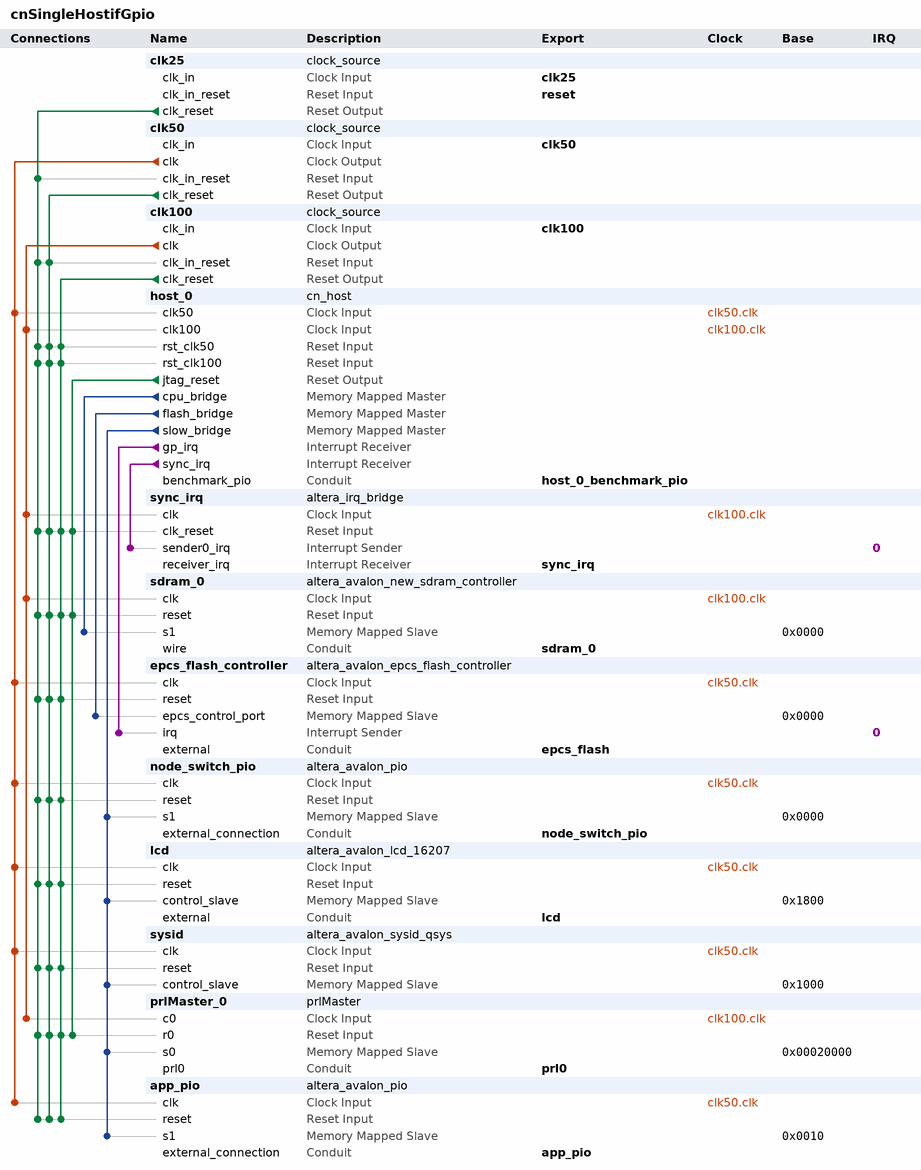
[diagram p0: system contents]
# Platform Designer (Qsys) system cnSingleHostifGpio, Cyclone IV E EP4CE115F29C7
# Parameters at their usual value, and those the tool derives, are not listed.
package require -exact qsys 13.0
create_system cnSingleHostifGpio
set_project_property DEVICE_FAMILY {Cyclone IV E}
set_project_property DEVICE EP4CE115F29C7

add_instance clk25 clock_source 13.0
set_instance_parameter_value clk25 clockFrequency 25000000

add_instance clk50 clock_source 13.0
set_instance_parameter_value clk50 clockFrequency 50000000

add_instance clk100 clock_source 13.0
set_instance_parameter_value clk100 clockFrequency 100000000

add_instance host_0 cn_host 1.0

add_instance sync_irq altera_irq_bridge 13.0
set_instance_parameter_value sync_irq IRQ_WIDTH 1

add_instance sdram_0 altera_avalon_new_sdram_controller 13.0.1.99.2
set_instance_parameter_value sdram_0 TAC 6.0
set_instance_parameter_value sdram_0 TRCD 20.0
set_instance_parameter_value sdram_0 TRP 20.0
set_instance_parameter_value sdram_0 casLatency 3
set_instance_parameter_value sdram_0 columnWidth 10
set_instance_parameter_value sdram_0 dataWidth 32
set_instance_parameter_value sdram_0 generateSimulationModel false
set_instance_parameter_value sdram_0 model single_Micron_MT48LC4M32B2_7_chip
set_instance_parameter_value sdram_0 numberOfBanks 4
set_instance_parameter_value sdram_0 numberOfChipSelects 1
set_instance_parameter_value sdram_0 powerUpDelay 100.0
set_instance_parameter_value sdram_0 refreshPeriod 7.8125
set_instance_parameter_value sdram_0 rowWidth 13

add_instance epcs_flash_controller altera_avalon_epcs_flash_controller 13.0.1.99.2

add_instance node_switch_pio altera_avalon_pio 13.0.1.99.2
set_instance_parameter_value node_switch_pio direction Input
set_instance_parameter_value node_switch_pio width 8

add_instance lcd altera_avalon_lcd_16207 13.0.1.99.2

add_instance sysid altera_avalon_sysid_qsys 13.0
set_instance_parameter_value sysid id 0

add_instance prlMaster_0 prlMaster 1.0.2
set_instance_parameter_value prlMaster_0 sys_clk 100000000
set_instance_parameter_value prlMaster_0 gui_enableMux true
set_instance_parameter_value prlMaster_0 gui_dataWidth 16
set_instance_parameter_value prlMaster_0 gui_addrWidth 17

add_instance app_pio altera_avalon_pio 13.0.1.99.2
set_instance_parameter_value app_pio direction InOut
set_instance_parameter_value app_pio width 32

# connections
add_connection clk50.clk app_pio.clk clock
add_connection clk50.clk epcs_flash_controller.clk clock
add_connection clk50.clk host_0.clk50 clock
add_connection clk50.clk lcd.clk clock
add_connection clk50.clk node_switch_pio.clk clock
add_connection clk50.clk sysid.clk clock
add_connection clk100.clk host_0.clk100 clock
add_connection clk100.clk prlMaster_0.c0 clock
add_connection clk100.clk sdram_0.clk clock
add_connection clk100.clk sync_irq.clk clock
add_connection clk25.clk_reset app_pio.reset reset
add_connection clk25.clk_reset clk50.clk_in_reset reset
add_connection clk25.clk_reset clk100.clk_in_reset reset
add_connection clk25.clk_reset epcs_flash_controller.reset reset
add_connection clk25.clk_reset host_0.rst_clk50 reset
add_connection clk25.clk_reset host_0.rst_clk100 reset
add_connection clk25.clk_reset lcd.reset reset
add_connection clk25.clk_reset node_switch_pio.reset reset
add_connection clk25.clk_reset prlMaster_0.r0 reset
add_connection clk25.clk_reset sdram_0.reset reset
add_connection clk25.clk_reset sync_irq.clk_reset reset
add_connection clk25.clk_reset sysid.reset reset
add_connection clk50.clk_reset app_pio.reset reset
add_connection clk50.clk_reset clk100.clk_in_reset reset
add_connection clk50.clk_reset epcs_flash_controller.reset reset
add_connection clk50.clk_reset host_0.rst_clk50 reset
add_connection clk50.clk_reset host_0.rst_clk100 reset
add_connection clk50.clk_reset lcd.reset reset
add_connection clk50.clk_reset node_switch_pio.reset reset
add_connection clk50.clk_reset prlMaster_0.r0 reset
add_connection clk50.clk_reset sdram_0.reset reset
add_connection clk50.clk_reset sync_irq.clk_reset reset
add_connection clk50.clk_reset sysid.reset reset
add_connection clk100.clk_reset app_pio.reset reset
add_connection clk100.clk_reset epcs_flash_controller.reset reset
add_connection clk100.clk_reset host_0.rst_clk50 reset
add_connection clk100.clk_reset host_0.rst_clk100 reset
add_connection clk100.clk_reset lcd.reset reset
add_connection clk100.clk_reset node_switch_pio.reset reset
add_connection clk100.clk_reset prlMaster_0.r0 reset
add_connection clk100.clk_reset sdram_0.reset reset
add_connection clk100.clk_reset sync_irq.clk_reset reset
add_connection clk100.clk_reset sysid.reset reset
add_connection host_0.jtag_reset prlMaster_0.r0 reset
add_connection host_0.jtag_reset sdram_0.reset reset
add_connection host_0.jtag_reset sync_irq.clk_reset reset
add_connection host_0.cpu_bridge sdram_0.s1 avalon
set_connection_parameter_value host_0.cpu_bridge/sdram_0.s1 baseAddress 0x0000
add_connection host_0.flash_bridge epcs_flash_controller.epcs_control_port avalon
set_connection_parameter_value host_0.flash_bridge/epcs_flash_controller.epcs_control_port baseAddress 0x0000
add_connection host_0.slow_bridge app_pio.s1 avalon
set_connection_parameter_value host_0.slow_bridge/app_pio.s1 baseAddress 0x0010
add_connection host_0.slow_bridge lcd.control_slave avalon
set_connection_parameter_value host_0.slow_bridge/lcd.control_slave baseAddress 0x1800
add_connection host_0.slow_bridge node_switch_pio.s1 avalon
set_connection_parameter_value host_0.slow_bridge/node_switch_pio.s1 baseAddress 0x0000
add_connection host_0.slow_bridge prlMaster_0.s0 avalon
set_connection_parameter_value host_0.slow_bridge/prlMaster_0.s0 baseAddress 0x00020000
add_connection host_0.slow_bridge sysid.control_slave avalon
set_connection_parameter_value host_0.slow_bridge/sysid.control_slave baseAddress 0x1000
add_connection host_0.gp_irq epcs_flash_controller.irq interrupt
set_connection_parameter_value host_0.gp_irq/epcs_flash_controller.irq irqNumber 0
add_connection host_0.sync_irq sync_irq.sender0_irq interrupt
set_connection_parameter_value host_0.sync_irq/sync_irq.sender0_irq irqNumber 0

# exported interfaces
add_interface clk50 clock sink
set_interface_property clk50 EXPORT_OF clk50.clk_in
add_interface clk100 clock sink
set_interface_property clk100 EXPORT_OF clk100.clk_in
add_interface clk25 clock sink
set_interface_property clk25 EXPORT_OF clk25.clk_in
add_interface reset reset sink
set_interface_property reset EXPORT_OF clk25.clk_in_reset
add_interface host_0_benchmark_pio conduit end
set_interface_property host_0_benchmark_pio EXPORT_OF host_0.benchmark_pio
add_interface epcs_flash conduit end
set_interface_property epcs_flash EXPORT_OF epcs_flash_controller.external
add_interface lcd conduit end
set_interface_property lcd EXPORT_OF lcd.external
add_interface sdram_0 conduit end
set_interface_property sdram_0 EXPORT_OF sdram_0.wire
add_interface node_switch_pio conduit end
set_interface_property node_switch_pio EXPORT_OF node_switch_pio.external_connection
add_interface sync_irq interrupt receiver
set_interface_property sync_irq EXPORT_OF sync_irq.receiver_irq
add_interface prl0 conduit end
set_interface_property prl0 EXPORT_OF prlMaster_0.prl0
add_interface app_pio conduit end
set_interface_property app_pio EXPORT_OF app_pio.external_connection

set_interconnect_requirement {$system} qsys_mm.clockCrossingAdapter HANDSHAKE
set_interconnect_requirement {$system} qsys_mm.maxAdditionalLatency 1

save_system cnSingleHostifGpio.qsys
